# EAGLE design midi-hid (EAGLE 7.7.0)
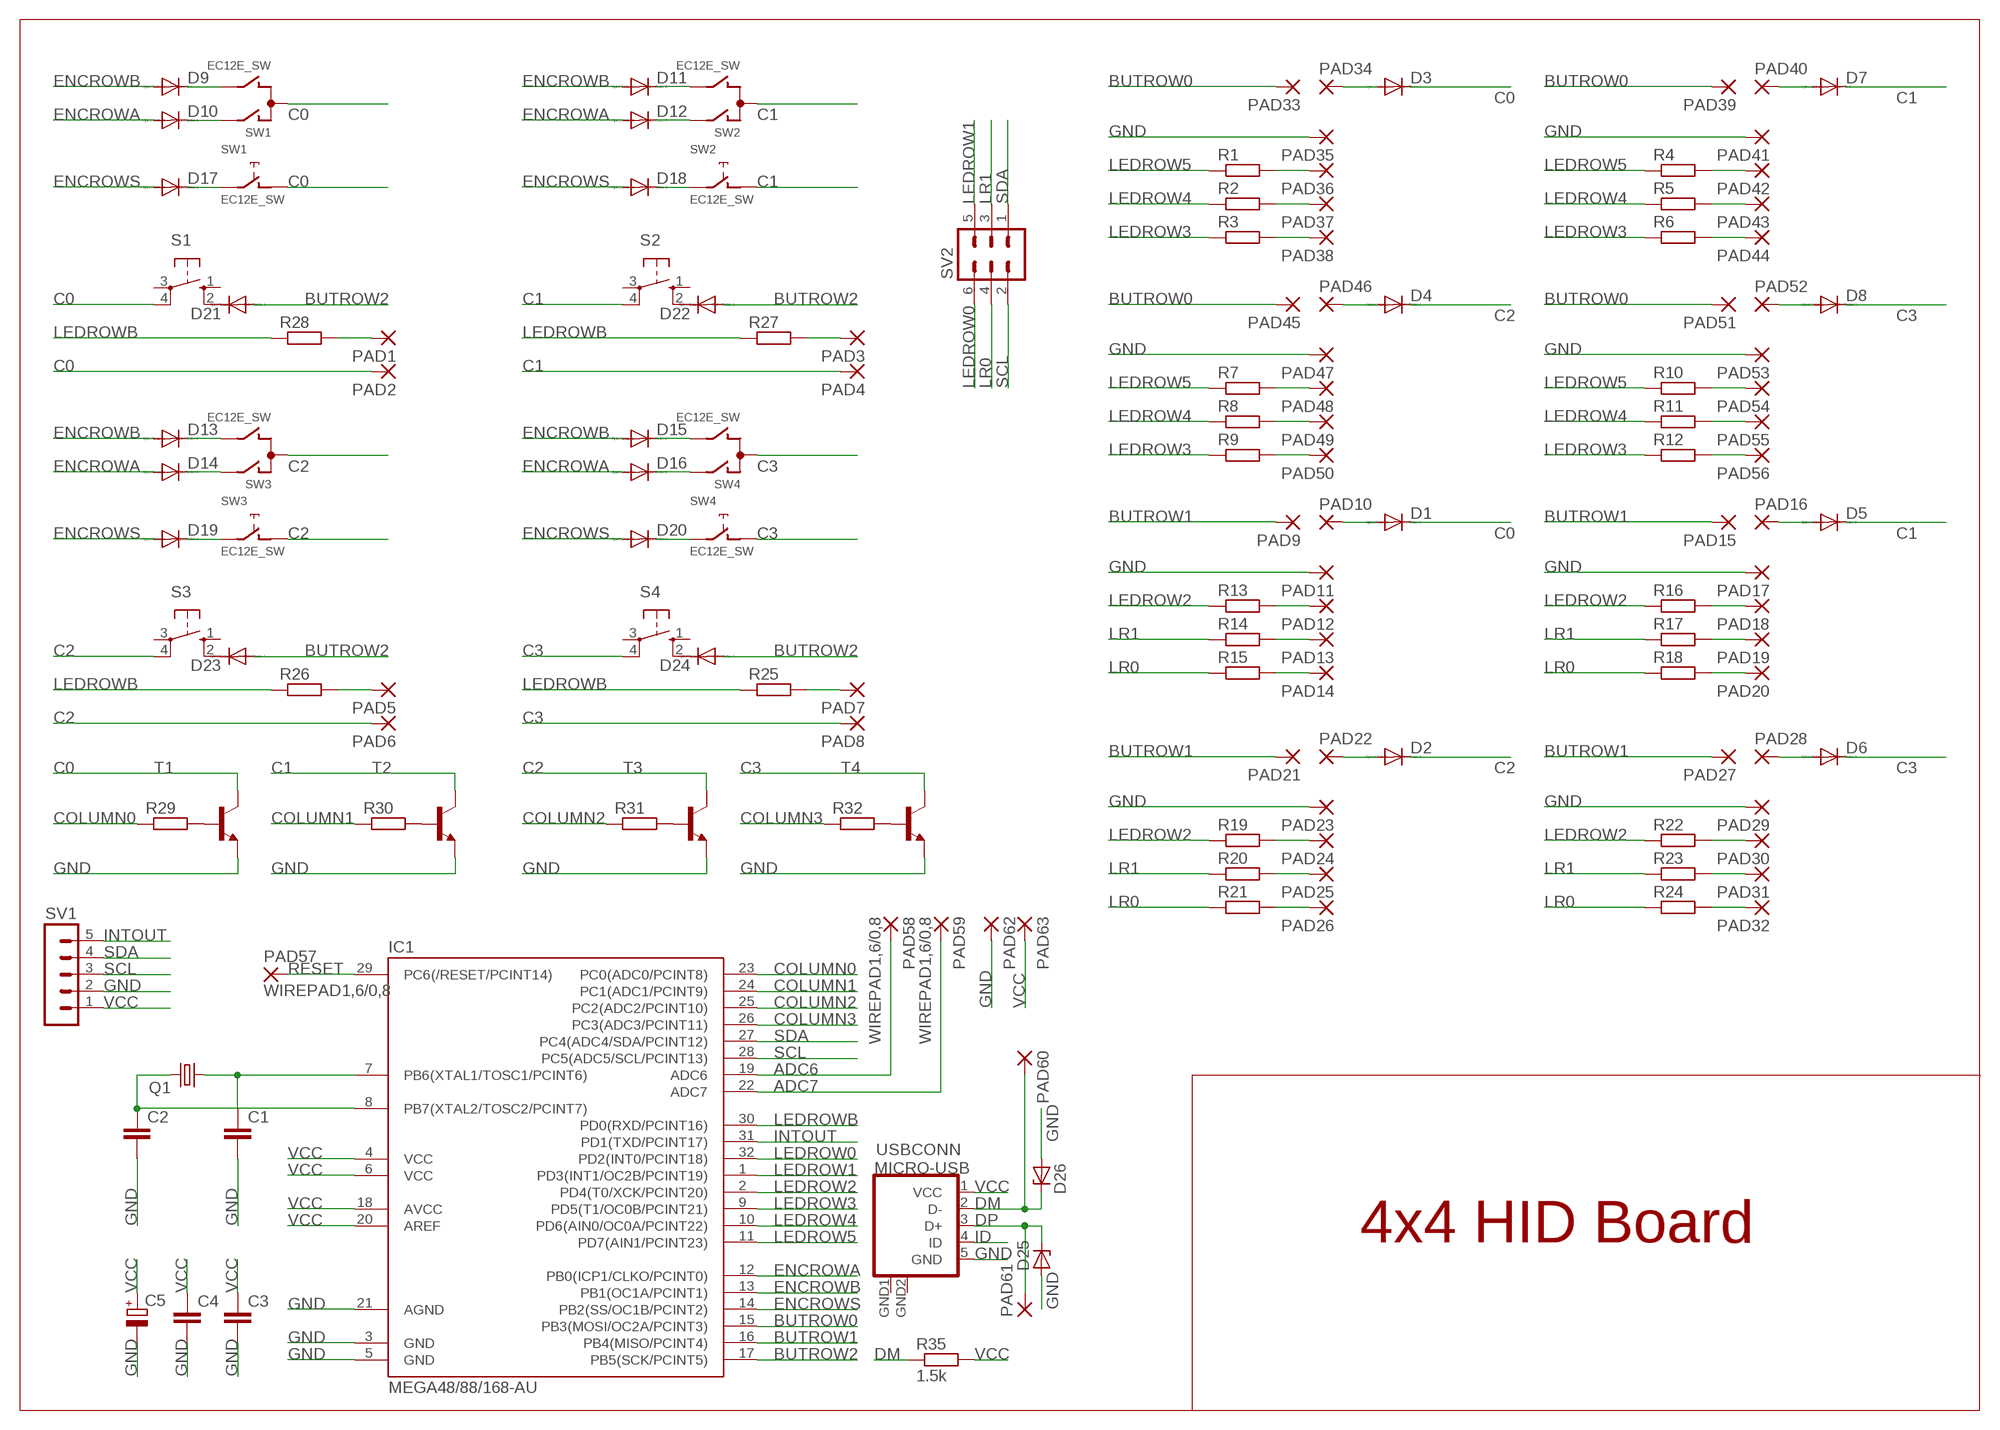
[diagram p0: schematic, sheet 1]

## Parts
C1  C-EUC0805  [C0805]
C2  C-EUC0805  [C0805]
C3  C-EUC0805  [C0805]
C4  C-EUC0805  [C0805]
C5  CPOL-EUE2.5-6  [E2,5-6]
D1  DIODE-SOD80C  [SOD80C]
D2  DIODE-SOD80C  [SOD80C]
D3  DIODE-SOD80C  [SOD80C]
D4  DIODE-SOD80C  [SOD80C]
D5  DIODE-SOD80C  [SOD80C]
D6  DIODE-SOD80C  [SOD80C]
D7  DIODE-SOD80C  [SOD80C]
D8  DIODE-SOD80C  [SOD80C]
D9  DIODE-SOD80C  [SOD80C]
D10  DIODE-SOD80C  [SOD80C]
D11  DIODE-SOD80C  [SOD80C]
D12  DIODE-SOD80C  [SOD80C]
D13  DIODE-SOD80C  [SOD80C]
D14  DIODE-SOD80C  [SOD80C]
D15  DIODE-SOD80C  [SOD80C]
D16  DIODE-SOD80C  [SOD80C]
D17  DIODE-SOD80C  [SOD80C]
D18  DIODE-SOD80C  [SOD80C]
D19  DIODE-SOD80C  [SOD80C]
D20  DIODE-SOD80C  [SOD80C]
D21  DIODE-SOD80C  [SOD80C]
D22  DIODE-SOD80C  [SOD80C]
D23  DIODE-SOD80C  [SOD80C]
D24  DIODE-SOD80C  [SOD80C]
D25  ZENER-DIODESOD80C  [SOD80C]
D26  ZENER-DIODESOD80C  [SOD80C]
IC1  MEGA48/88/168-AU  [TQFP32-08]
PAD1  1,6/0,8  [1,6/0,8]
PAD2  1,6/0,8  [1,6/0,8]
PAD3  1,6/0,8  [1,6/0,8]
PAD4  1,6/0,8  [1,6/0,8]
PAD5  1,6/0,8  [1,6/0,8]
PAD6  1,6/0,8  [1,6/0,8]
PAD7  1,6/0,8  [1,6/0,8]
PAD8  1,6/0,8  [1,6/0,8]
PAD9  1,6/0,8  [1,6/0,8]
PAD10  1,6/0,8  [1,6/0,8]
PAD11  1,6/0,8  [1,6/0,8]
PAD12  1,6/0,8  [1,6/0,8]
PAD13  1,6/0,8  [1,6/0,8]
PAD14  1,6/0,8  [1,6/0,8]
PAD15  1,6/0,8  [1,6/0,8]
PAD16  1,6/0,8  [1,6/0,8]
PAD17  1,6/0,8  [1,6/0,8]
PAD18  1,6/0,8  [1,6/0,8]
PAD19  1,6/0,8  [1,6/0,8]
PAD20  1,6/0,8  [1,6/0,8]
PAD21  1,6/0,8  [1,6/0,8]
PAD22  1,6/0,8  [1,6/0,8]
PAD23  1,6/0,8  [1,6/0,8]
PAD24  1,6/0,8  [1,6/0,8]
PAD25  1,6/0,8  [1,6/0,8]
PAD26  1,6/0,8  [1,6/0,8]
PAD27  1,6/0,8  [1,6/0,8]
PAD28  1,6/0,8  [1,6/0,8]
PAD29  1,6/0,8  [1,6/0,8]
PAD30  1,6/0,8  [1,6/0,8]
PAD31  1,6/0,8  [1,6/0,8]
PAD32  1,6/0,8  [1,6/0,8]
PAD33  1,6/0,8  [1,6/0,8]
PAD34  1,6/0,8  [1,6/0,8]
PAD35  1,6/0,8  [1,6/0,8]
PAD36  1,6/0,8  [1,6/0,8]
PAD37  1,6/0,8  [1,6/0,8]
PAD38  1,6/0,8  [1,6/0,8]
PAD39  1,6/0,8  [1,6/0,8]
PAD40  1,6/0,8  [1,6/0,8]
PAD41  1,6/0,8  [1,6/0,8]
PAD42  1,6/0,8  [1,6/0,8]
PAD43  1,6/0,8  [1,6/0,8]
PAD44  1,6/0,8  [1,6/0,8]
PAD45  1,6/0,8  [1,6/0,8]
PAD46  1,6/0,8  [1,6/0,8]
PAD47  1,6/0,8  [1,6/0,8]
PAD48  1,6/0,8  [1,6/0,8]
PAD49  1,6/0,8  [1,6/0,8]
PAD50  1,6/0,8  [1,6/0,8]
PAD51  1,6/0,8  [1,6/0,8]
PAD52  1,6/0,8  [1,6/0,8]
PAD53  1,6/0,8  [1,6/0,8]
PAD54  1,6/0,8  [1,6/0,8]
PAD55  1,6/0,8  [1,6/0,8]
PAD56  1,6/0,8  [1,6/0,8]
PAD57  WIREPAD1,6/0,8  [1,6/0,8]
PAD58  WIREPAD1,6/0,8  [1,6/0,8]
PAD59  WIREPAD1,6/0,8  [1,6/0,8]
PAD60  1,6/0,8  [1,6/0,8]
PAD61  1,6/0,8  [1,6/0,8]
PAD62  1,6/0,8  [1,6/0,8]
PAD63  1,6/0,8  [1,6/0,8]
Q1  CRYSTALHC49S  [HC49/S]
R1  R-EU_R0805  [R0805]
R2  R-EU_R0805  [R0805]
R3  R-EU_R0805  [R0805]
R4  R-EU_R0805  [R0805]
R5  R-EU_R0805  [R0805]
R6  R-EU_R0805  [R0805]
R7  R-EU_R0805  [R0805]
R8  R-EU_R0805  [R0805]
R9  R-EU_R0805  [R0805]
R10  R-EU_R0805  [R0805]
R11  R-EU_R0805  [R0805]
R12  R-EU_R0805  [R0805]
R13  R-EU_R0805  [R0805]
R14  R-EU_R0805  [R0805]
R15  R-EU_R0805  [R0805]
R16  R-EU_R0805  [R0805]
R17  R-EU_R0805  [R0805]
R18  R-EU_R0805  [R0805]
R19  R-EU_R0805  [R0805]
R20  R-EU_R0805  [R0805]
R21  R-EU_R0805  [R0805]
R22  R-EU_R0805  [R0805]
R23  R-EU_R0805  [R0805]
R24  R-EU_R0805  [R0805]
R25  R-EU_R0805  [R0805]
R26  R-EU_R0805  [R0805]
R27  R-EU_R0805  [R0805]
R28  R-EU_R0805  [R0805]
R29  R-EU_R0805  [R0805]
R30  R-EU_R0805  [R0805]
R31  R-EU_R0805  [R0805]
R32  R-EU_R0805  [R0805]
R35  1.5k  R-EU_R0805  [R0805]
S1  40-XX  [B3F-40XX]
S2  40-XX  [B3F-40XX]
S3  40-XX  [B3F-40XX]
S4  40-XX  [B3F-40XX]
SV1  MA05-1  [MA05-1]
SV2  MA03-2  [MA03-2]
SW1  EC12E_SW  [ALPS_EC12E_SW]
SW2  EC12E_SW  [ALPS_EC12E_SW]
SW3  EC12E_SW  [ALPS_EC12E_SW]
SW4  EC12E_SW  [ALPS_EC12E_SW]
T1  MMBT3904LT1-NPN-SOT23-BEC  [SOT23-BEC]
T2  MMBT3904LT1-NPN-SOT23-BEC  [SOT23-BEC]
T3  MMBT3904LT1-NPN-SOT23-BEC  [SOT23-BEC]
T4  MMBT3904LT1-NPN-SOT23-BEC  [SOT23-BEC]
USBCONN  MICRO-USB  [MICRO-USB]

## Nets
ADC6: IC1.19(ADC6) PAD58.1(P)
ADC7: IC1.22(ADC7) PAD59.1(P)
BUTROW0: IC1.15(PB3(MOSI/OC2A/PCINT3)) PAD33.1(P) PAD39.1(P) PAD45.1(P) PAD51.1(P)
BUTROW1: IC1.16(PB4(MISO/PCINT4)) PAD9.1(P) PAD15.1(P) PAD21.1(P) PAD27.1(P)
BUTROW2: D21.A D22.A D23.A D24.A IC1.17(PB5(SCK/PCINT5))
C0: D1.C D3.C PAD2.1(P) S1.4(P1) SW1.C SW1.D T1.C
C1: D5.C D7.C PAD4.1(P) S2.4(P1) SW2.C SW2.D T2.C
C2: D2.C D4.C PAD6.1(P) S3.4(P1) SW3.C SW3.D T3.C
C3: D6.C D8.C PAD8.1(P) S4.4(P1) SW4.C SW4.D T4.C
COLUMN0: IC1.23(PC0(ADC0/PCINT8)) R29.1
COLUMN1: IC1.24(PC1(ADC1/PCINT9)) R30.1
COLUMN2: IC1.25(PC2(ADC2/PCINT10)) R31.1
COLUMN3: IC1.26(PC3(ADC3/PCINT11)) R32.1
DM: D26.C PAD60.1(P) R35.1 USBCONN.2(D-)
DP: D25.C PAD61.1(P) USBCONN.3(D+)
ENCROWA: D10.A D12.A D14.A D16.A IC1.12(PB0(ICP1/CLKO/PCINT0))
ENCROWB: D9.A D11.A D13.A D15.A IC1.13(PB1(OC1A/PCINT1))
ENCROWS: D17.A D18.A D19.A D20.A IC1.14(PB2(SS/OC1B/PCINT2))
GND: C1.2 C2.2 C3.2 C4.2 C5.- D25.A D26.A IC1.3(GND) IC1.5(GND) IC1.21(AGND) PAD11.1(P) PAD17.1(P) PAD23.1(P) PAD29.1(P) PAD35.1(P) PAD41.1(P) PAD47.1(P) PAD53.1(P) PAD62.1(P) SV1.2 T1.E T2.E T3.E T4.E USBCONN.5(GND)
ID: USBCONN.4(ID)
INTOUT: IC1.31(PD1(TXD/PCINT17)) SV1.5
LEDROW0: IC1.32(PD2(INT0/PCINT18)) SV2.6
LEDROW1: IC1.1(PD3(INT1/OC2B/PCINT19)) SV2.5
LEDROW2: IC1.2(PD4(T0/XCK/PCINT20)) R13.1 R16.1 R19.1 R22.1
LEDROW3: IC1.9(PD5(T1/OC0B/PCINT21)) R3.1 R6.1 R9.1 R12.1
LEDROW4: IC1.10(PD6(AIN0/OC0A/PCINT22)) R2.1 R5.1 R8.1 R11.1
LEDROW5: IC1.11(PD7(AIN1/PCINT23)) R1.1 R4.1 R7.1 R10.1
LEDROWB: IC1.30(PD0(RXD/PCINT16)) R25.1 R26.1 R27.1 R28.1
LR0: R15.1 R18.1 R21.1 R24.1 SV2.4
LR1: R14.1 R17.1 R20.1 R23.1 SV2.3
N$1: D9.C SW1.B
N$2: D10.C SW1.A
N$3: D17.C SW1.E
N$6: D11.C SW2.B
N$7: D12.C SW2.A
N$8: D18.C SW2.E
N$11: D13.C SW3.B
N$12: D14.C SW3.A
N$13: D19.C SW3.E
N$14: D15.C SW4.B
N$15: D16.C SW4.A
N$16: D20.C SW4.E
N$21: C1.1 IC1.7(PB6(XTAL1/TOSC1/PCINT6)) Q1.1
N$22: C2.1 IC1.8(PB7(XTAL2/TOSC2/PCINT7)) Q1.2
N$23: R29.2 T1.B
N$24: PAD36.1(P) R1.2
N$25: PAD37.1(P) R2.2
N$26: PAD38.1(P) R3.2
N$27: R30.2 T2.B
N$28: PAD42.1(P) R4.2
N$29: PAD43.1(P) R5.2
N$30: PAD44.1(P) R6.2
N$31: R31.2 T3.B
N$32: PAD48.1(P) R7.2
N$33: PAD49.1(P) R8.2
N$34: PAD50.1(P) R9.2
N$35: R32.2 T4.B
N$36: PAD54.1(P) R10.2
N$37: PAD55.1(P) R11.2
N$38: PAD56.1(P) R12.2
N$40: D3.A PAD34.1(P)
N$42: D7.A PAD40.1(P)
N$44: D4.A PAD46.1(P)
N$46: D8.A PAD52.1(P)
N$47: PAD14.1(P) R15.2
N$48: PAD13.1(P) R14.2
N$49: PAD12.1(P) R13.2
N$51: PAD20.1(P) R18.2
N$52: PAD19.1(P) R17.2
N$53: PAD18.1(P) R16.2
N$56: PAD24.1(P) R19.2
N$57: PAD25.1(P) R20.2
N$58: PAD26.1(P) R21.2
N$59: PAD32.1(P) R24.2
N$60: PAD31.1(P) R23.2
N$61: PAD30.1(P) R22.2
N$64: D1.A PAD10.1(P)
N$66: D5.A PAD16.1(P)
N$68: D2.A PAD22.1(P)
N$70: D6.A PAD28.1(P)
N$72: PAD1.1(P) R28.2
N$74: PAD3.1(P) R27.2
N$76: PAD5.1(P) R26.2
N$78: PAD7.1(P) R25.2
N$88: D22.C S2.2(S1)
N$89: D21.C S1.2(S1)
N$90: D23.C S3.2(S1)
N$91: D24.C S4.2(S1)
RESET: IC1.29(PC6(/RESET/PCINT14)) PAD57.1(P)
SCL: IC1.28(PC5(ADC5/SCL/PCINT13)) SV1.3 SV2.2
SDA: IC1.27(PC4(ADC4/SDA/PCINT12)) SV1.4 SV2.1
VCC: C3.1 C4.1 C5.+ IC1.4(VCC) IC1.6(VCC) IC1.18(AVCC) IC1.20(AREF) PAD63.1(P) R35.2 SV1.1 USBCONN.1(VCC)
Unconnected: S1.1(S) S1.3(P) S2.1(S) S2.3(P) S3.1(S) S3.3(P) S4.1(S) S4.3(P) SW1.GND1(G) SW1.GND2(G) SW2.GND1(G) SW2.GND2(G) SW3.GND1(G) SW3.GND2(G) SW4.GND1(G) SW4.GND2(G)

## Notes on the sheet
- 4x4 HID Board

## Power pins joined to a net without a drawn wire
GND: USBCONN.GND1(GND) USBCONN.GND2(GND)

## Library data of the parts
C1-C4 = rcl:C-EU: CAPACITOR, European symbol
C5 = rcl:CPOL-EU: POLARIZED CAPACITOR, European symbol
D1-D24 = diode:DIODE-: DIODE
D25 D26 = diode:ZENER-DIODE: Z-Diode
IC1 = avr-7:MEGA48/88/168
PAD1-PAD56 PAD60-PAD63 = wirepad:1,6/0,8: THROUGH-HOLE PAD
PAD57-PAD59 = wirepad:WIREPAD: Wire PAD connect wire on PCB
Q1 = crystal:CRYSTAL: CRYSTAL; OC_FARNELL: 1667008; OC_NEWARK: unknown
R1-R32 R35 = rcl:R-EU_: RESISTOR, European symbol
S1-S4 = switch-omron:40-XX: OMRON SWITCH; MF: OMRON COMPONENTS USA; MPN: B3F-4000; OC_FARNELL: 176434; OC_NEWARK: 36K3105
SV1 = con-lstb:MA05-1: PIN HEADER; OC_FARNELL: unknown; OC_NEWARK: unknown
SV2 = con-lstb:MA03-2: PIN HEADER; OC_FARNELL: unknown; OC_NEWARK: unknown
SW1-SW4 = switch-alps:EC12E_SW: ALPS rotary Encoder EC12E series with switch; MPN: EC12E2424407; OC_FARNELL: 1520813; OC_NEWARK: 74M1068
T1-T4 = transistor:*-NPN-: NPN Transistror BF959 corrected 2008.03.06
USBCONN = microusb:MICRO-USB: Micro USB B connector

## Board
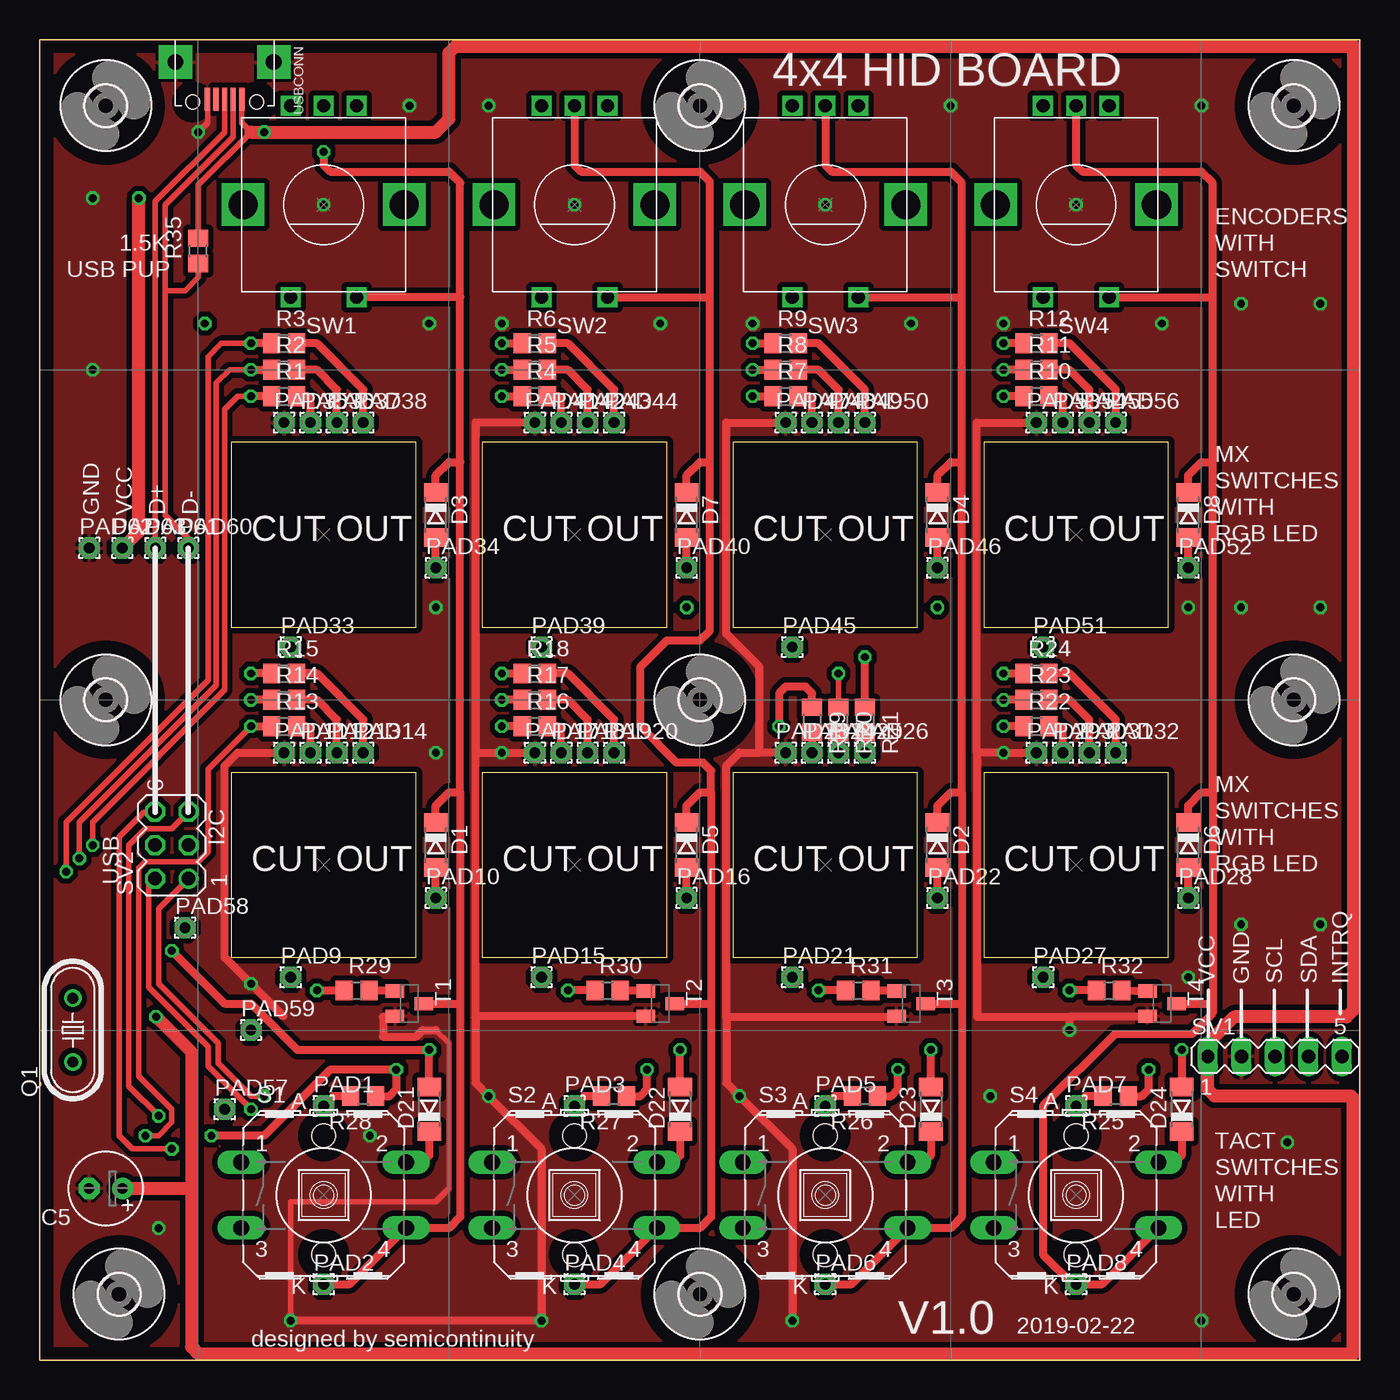
[diagram p1: board, top side]
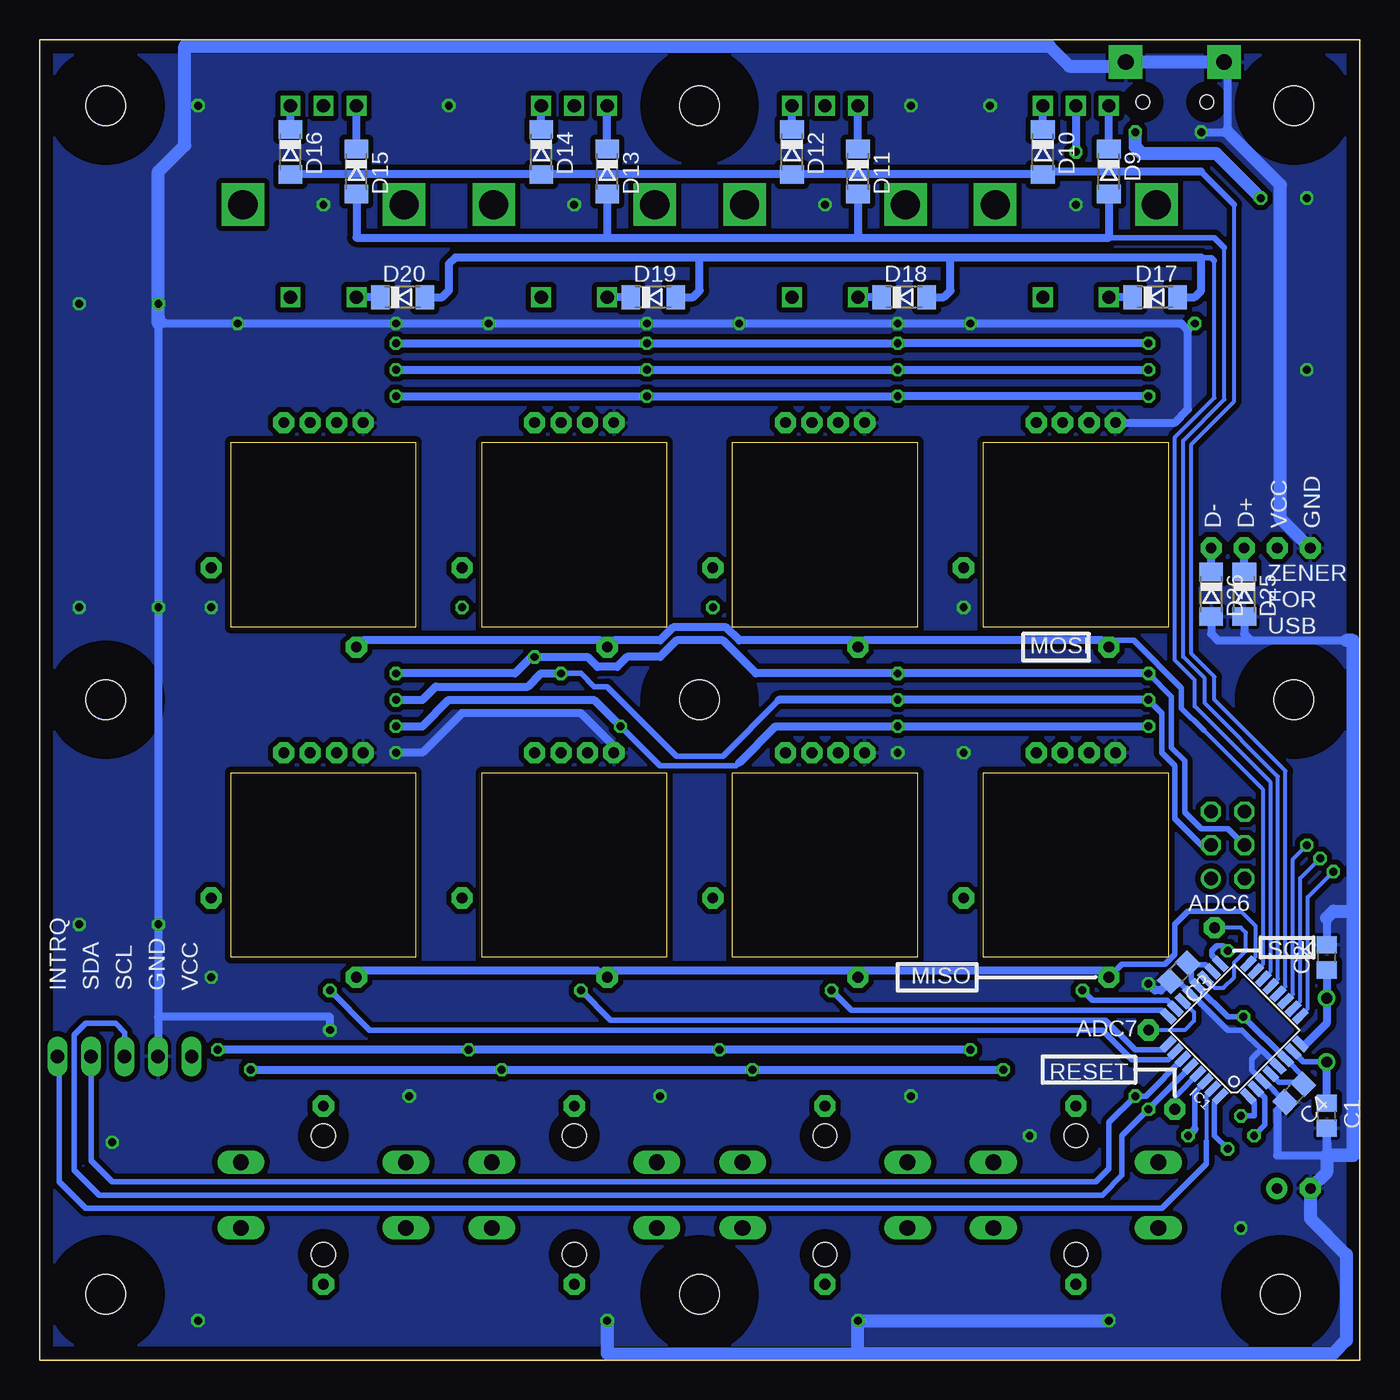
[diagram p2: board, bottom side, seen from below]

Size 100 x 100 mm. Coordinates in mm from the lower left corner, seen from the top.
Outline: 0,0 100,0 100,100 0,100 0,0
Copper layers (1*16): Top 0.035mm / dielectric 1.5mm / Bottom 0.035mm
Design rules "default": minimum track width 10mil, minimum drill 24mil, track to track 8mil, track to pad 8mil, pad to pad 8mil, via to via 8mil, smd to smd 8mil, copper to edge 40mil, drill to drill 8mil, minimum pad ring 10mil, minimum via ring 8mil, stop-mask expansion 4mil, vias tented up to drill 0mil, thermal gap 10mil
tRestrict: area 33.5,55.5 to 47.5,69.5; area 52.5,55.5 to 66.5,69.5; area 71.5,55.5 to 85.5,69.5; area 14.5,55.5 to 28.5,69.5; area 14.5,30.5 to 28.5,44.5; area 33.5,30.5 to 47.5,44.5; area 52.5,30.5 to 66.5,44.5; area 71.5,30.5 to 85.5,44.5
bRestrict: area 14.5,30.5 to 28.5,44.5; area 33.5,30.5 to 47.5,44.5; area 52.5,30.5 to 66.5,44.5; area 71.5,30.5 to 85.5,44.5; area 14.5,55.5 to 28.5,69.5; area 33.5,55.5 to 47.5,69.5; area 52.5,55.5 to 66.5,69.5; area 71.5,55.5 to 85.5,69.5
Milling: 36 lines

### Footprints (pad centres in the part's own frame; a part is rotated, then mirrored left to right if it is on the bottom)
C0805 = smd 1.3 x 1.5: 1 -0.95,0; 2 0.95,0
E2,5-6 = drill 0.813 pad 1.6: + -1.27,0 | drill 0.813 pad 1.6 octagon: - 1.27,0
SOD80C = smd 1.4 x 1.8: A 1.7,0; C -1.7,0
TQFP32-08 = smd 1.27 x 0.559: 1 -4.293,2.8; 2 -4.293,2; 3 -4.293,1.2; 4 -4.293,0.4; 5 -4.293,-0.4; 6 -4.293,-1.2; 7 -4.293,-2; 8 -4.293,-2.8; 17 4.293,-2.8; 18 4.293,-2; 19 4.293,-1.2; 20 4.293,-0.4; 21 4.293,0.4; 22 4.293,1.2; 23 4.293,2; 24 4.293,2.8 | smd 0.559 x 1.27: 9 -2.8,-4.293; 10 -2,-4.293; 11 -1.2,-4.293; 12 -0.4,-4.293; 13 0.4,-4.293; 14 1.2,-4.293; 15 2,-4.293; 16 2.8,-4.293; 25 2.8,4.293; 26 2,4.293; 27 1.2,4.293; 28 0.4,4.293; 29 -0.4,4.293; 30 -1.2,4.293; 31 -2,4.293; 32 -2.8,4.293
1,6/0,8 = drill 0.813 pad 1.6 octagon: 1 0,0
HC49/S = drill 0.813: 1 -2.413,0; 2 2.413,0
R0805 = smd 1.3 x 1.5: 1 -0.95,0; 2 0.95,0
B3F-40XX = drill 1.194 long: 1 -6.248,2.489; 2 6.248,2.489; 3 -6.248,-2.489; 4 6.248,-2.489 | hole 1.803: 0,-4.496; 0,4.496
MA05-1 = drill 1.016 long: 1 -5.08,0; 2 -2.54,0; 3 0,0; 4 2.54,0; 5 5.08,0
MA03-2 = drill 1.016: 1 -2.54,-1.27 | drill 1.016 octagon: 2 -2.54,1.27; 3 0,-1.27; 4 0,1.27; 5 2.54,-1.27; 6 2.54,1.27
ALPS_EC12E_SW = drill 1 square: A -2.5,-7.5; B 2.5,-7.5; C 0,-7.5; D -2.5,7; E 2.5,7 | drill 2.2 square: GND1 -6.1,0; GND2 6.1,0
SOT23-BEC = smd 1 x 1.4: B -0.95,-1.1; C 0,1.1; E 0.95,-1.1
3,0 = hole 3: 0,0
MICRO-USB = smd 0.4 x 1.75: 1 -1.3,4.525; 2 -0.65,4.525; 3 0,4.525; 4 0.65,4.525; 5 1.3,4.525 | drill 1.2 pad 2.54 square: GND1 -3.725,1.7; GND2 3.725,1.7 | hole 1.05: -2.425,4.73; 2.425,4.73

### Placement (x,y rotation side)
C1  2.5,18.5 270 bottom
C2  2.5,30.5 90 bottom
C3  13.69,29.38 225 bottom
C4  4.96,20.22 225 bottom
C5  5,13 180 top
D1  30,39 270 top
D2  68,39 270 top
D3  30,64 270 top
D4  68,64 270 top
D5  49,39 270 top
D6  87,39 270 top
D7  49,64 270 top
D8  87,64 270 top
D9  19,90 270 bottom
D10  24,91.5 270 bottom
D11  38,90 270 bottom
D12  43,91.5 270 bottom
D13  57,90 270 bottom
D14  62,91.5 270 bottom
D15  76,90 270 bottom
D16  81,91.5 270 bottom
D17  15.5,80.5 0 bottom
D18  34.5,80.5 0 bottom
D19  53.5,80.5 0 bottom
D20  72.5,80.5 0 bottom
D21  29.5,19 90 top
D22  48.5,19 90 top
D23  67.5,19 90 top
D24  86.5,19 90 top
D25  8.75,58 270 bottom
D26  11.25,58 270 bottom
IC1  9.5,25 135 bottom
PAD1  21.5,19.25 0 top
PAD2  21.5,5.75 0 top
PAD3  40.5,19.25 0 top
PAD4  40.5,5.75 0 top
PAD5  59.5,19.25 0 top
PAD6  59.5,5.75 0 top
PAD7  78.5,19.25 0 top
PAD8  78.5,5.75 0 top
PAD9  19,29 0 top
PAD10  30,35 0 top
PAD11  18.5,46 0 top
PAD12  20.5,46 0 top
PAD13  22.5,46 0 top
PAD14  24.5,46 0 top
PAD15  38,29 0 top
PAD16  49,35 0 top
PAD17  37.5,46 0 top
PAD18  39.5,46 0 top
PAD19  41.5,46 0 top
PAD20  43.5,46 0 top
PAD21  57,29 0 top
PAD22  68,35 0 top
PAD23  56.5,46 0 top
PAD24  58.5,46 0 top
PAD25  60.5,46 0 top
PAD26  62.5,46 0 top
PAD27  76,29 0 top
PAD28  87,35 0 top
PAD29  75.5,46 0 top
PAD30  77.5,46 0 top
PAD31  79.5,46 0 top
PAD32  81.5,46 0 top
PAD33  19,54 0 top
PAD34  30,60 0 top
PAD35  18.5,71 0 top
PAD36  20.5,71 0 top
PAD37  22.5,71 0 top
PAD38  24.5,71 0 top
PAD39  38,54 0 top
PAD40  49,60 0 top
PAD41  37.5,71 0 top
PAD42  39.5,71 0 top
PAD43  41.5,71 0 top
PAD44  43.5,71 0 top
PAD45  57,54 0 top
PAD46  68,60 0 top
PAD47  56.5,71 0 top
PAD48  58.5,71 0 top
PAD49  60.5,71 0 top
PAD50  62.5,71 0 top
PAD51  76,54 0 top
PAD52  87,60 0 top
PAD53  75.5,71 0 top
PAD54  77.5,71 0 top
PAD55  79.5,71 0 top
PAD56  81.5,71 0 top
PAD57  14,19 0 top
PAD58  11,32.75 0 top
PAD59  16,25 0 top
PAD60  11.25,61.5 0 top
PAD61  8.75,61.5 0 top
PAD62  3.75,61.5 0 top
PAD63  6.25,61.5 0 top
Q1  2.5,25 90 top
R1  18.5,73 0 top
R2  18.5,75 0 top
R3  18.5,77 0 top
R4  37.5,73 0 top
R5  37.5,75 0 top
R6  37.5,77 0 top
R7  56.5,73 0 top
R8  56.5,75 0 top
R9  56.5,77 0 top
R10  75.5,73 0 top
R11  75.5,75 0 top
R12  75.5,77 0 top
R13  18.5,48 0 top
R14  18.5,50 0 top
R15  18.5,52 0 top
R16  37.5,48 0 top
R17  37.5,50 0 top
R18  37.5,52 0 top
R19  58.5,48.5 270 top
R20  60.5,48.5 270 top
R21  62.5,48.5 270 top
R22  75.5,48 0 top
R23  75.5,50 0 top
R24  75.5,52 0 top
R25  81.5,20 180 top
R26  62.5,20 180 top
R27  43.5,20 180 top
R28  24.5,20 180 top
R29  24,28 0 top
R30  43,28 0 top
R31  62,28 0 top
R32  81,28 0 top
R35  12,84 90 top
S1  21.5,12.5 0 top
S2  40.5,12.5 0 top
S3  59.5,12.5 0 top
S4  78.5,12.5 0 top
SV1  93.56,23 0 top
SV2  10,39 90 top
SW1  21.5,87.5 180 top
SW2  40.5,87.5 180 top
SW3  59.5,87.5 180 top
SW4  78.5,87.5 180 top
T1  28,27 270 top
T2  47,27 270 top
T3  66,27 270 top
T4  85,27 270 top
U$1  [3,0]  95,5 0 top
U$2  [3,0]  50,5 0 top
U$3  [3,0]  95,95 0 top
U$4  [3,0]  6,5 0 top
U$5  [3,0]  5,50 0 top
U$6  [3,0]  95,50 0 top
U$7  [3,0]  50,50 0 top
U$8  [3,0]  50,95 0 top
U$9  [3,0]  5,95 0 top
USBCONN  14,100 180 top

### Tracks (layer width: path | path; a pad name or v marks a point on that pad's centre or on a via)
ADC6
  Bottom 0.303: 9.5,29 9.5,30.12
  Bottom 0.305: IC1.19 11,28.19 10.31,28.19 9.5,29 | 9.5,30.12 8.62,31 8.62,32.38 9,32.75 PAD58.1
ADC7
  Bottom 0.305: IC1.22 12.56,26.36 12.56,25.69 13.25,25 PAD59.1
BUTROW0
  Bottom 0.305: IC1.15 7.31,30.02 7.31,43.19 11.81,47.69
  Bottom 0.406: PAD33.1 18.5,54.5 17.12,54.5 13.5,50.88 13.5,49.38 11.81,47.69
  Bottom 0.61: PAD33.1 19.5,54.5 37.5,54.5 PAD39.1 38.5,54.5 47,54.5 48,55.5 52,55.5 53,54.5 56.5,54.5 PAD45.1 57.5,54.5 75.5,54.5 PAD51.1
BUTROW1
  Bottom 0.305: IC1.16 7.88,30.59 7.88,32.88 9,34
  Bottom 0.406: PAD9.1 18,30 14.75,30 14,30.75 14,33 13,34 9,34
  Bottom 0.61: PAD9.1 19.5,29.5 37.5,29.5 PAD15.1 38.5,29.5 56.5,29.5 PAD21.1 57.25,29 57.75,29.5 75.5,29.5 PAD27.1
BUTROW2  (via drill 0.6)
  Top 0.61: D21.A v29.5,23.5 19.5,23.5 16,27 14,27 v10,31 | v86.5,23.5 D24.A | D23.A v67.5,23.5 | D22.A v48.5,23.5
  Bottom 0.406: IC1.17 11.19,30.65 11.19,31 10.81,31.38 10.38,31.38 v10,31
  Bottom 0.61: v29.5,23.5 v48.5,23.5 v67.5,23.5 v86.5,23.5
C0  (via drill 0.6)
  Top 0.61: 31.85,43 31.85,68 | 31.85,68 31.85,80.5 | 31.85,80.5 31.85,89.15 31,90 22,90 21.5,90.5 v21.5,91.5 | 31.85,80.5 SW1.D | D1.C 30,42 31,43 31.85,43 | D3.C 30,67 31,68 31.85,68 | 31.85,43 31.85,27 | T1.C 31.85,27 | 31.85,27 31.85,10.85 31,10 S1.4 23.49,5.75 PAD2.1
  Bottom 0.61: SW1.C v21.5,91.5
C1
  Top 0.61: 50.85,43 50.85,44.65 50.25,45.25 48.25,45.25 45.5,48 45.5,52.5 47.5,54.5 50,54.5 50.75,55.25 50.75,68 | 50.75,68 50.75,80.5 | 50.75,80.5 50.75,89.25 50,90 41,90 40.5,90.5 SW2.C | SW2.D 50.75,80.5 | D7.C 49,67 50,68 50.75,68 | D5.C 49,42 50,43 50.85,43 | 50.85,43 50.85,27 | 50.85,27 50.85,10.85 50,10 S2.4 42.49,5.75 PAD4.1 | T2.C 50.85,27
C2
  Top 0.61: 69.85,43 69.85,68 | 69.85,68 69.85,80.5 | 69.85,80.5 69.85,89.15 69,90 60,90 59.5,90.5 SW3.C | SW3.D 69.85,80.5 | D4.C 68,67 69,68 69.85,68 | D2.C 68,42 69,43 69.85,43 | 69.85,43 69.85,27 | 69.85,27 69.85,10.85 69,10 S3.4 61.49,5.75 PAD6.1 | T3.C 69.85,27
C3
  Top 0.61: SW4.C 78.5,90.5 79,90 88,90 88.85,89.15 88.85,80.5 | 88.85,43 88.85,68 | 88.85,68 88.85,80.5 | SW4.D 88.85,80.5 | D8.C 87,67 88,68 88.85,68 | D6.C 87,42 88,43 88.85,43 | 88.85,43 88.85,27 | S4.4 80.49,5.75 PAD8.1 78.25,5.75 76,8 76,19.25 81.44,24.69 87.25,24.69 88.85,26.29 88.85,27 | T4.C 88.85,27
COLUMN0  (via drill 0.6)
  Top 0.61: v21,28 R29.1
  Bottom 0.406: IC1.23 14.58,27.25 20.25,27.25 v21,28
COLUMN1  (via drill 0.6)
  Top 0.61: R30.1 v40,28
  Bottom 0.406: IC1.24 14.55,26.05 15,26.5 38.5,26.5 v40,28
COLUMN2  (via drill 0.6)
  Top 0.61: R31.1 v59,28
  Bottom 0.406: IC1.25 14.96,23.5 17,23.5 19.25,25.75 56.75,25.75 v59,28
COLUMN3  (via drill 0.6)
  Top 0.61: R32.1 v78,28
  Bottom 0.406: IC1.26 13.95,23.3 14.5,22.75 17.25,22.75 19.5,25 75,25 v78,28
DM
  Top 0.406: USBCONN.2 14.65,92.65 9.5,87.5 9.5,81 | 9.5,81 9.5,64 11.25,62.25 PAD60.1 | R35.1 12,82 11,81 9.5,81
  Bottom 0.61: D26.C PAD60.1
DP
  Top 0.406: PAD61.1 8.75,87.75 14,93 USBCONN.3
  Bottom 0.61: D25.C PAD61.1
ENCROWA
  Bottom 0.305: IC1.12 5.62,28.31 5.62,44.62 11,50 11,51.75 12.75,53.5 12.75,69.38 9.5,72.62 9.5,87.5
  Bottom 0.406: 9.5,87.5 12,90
  Bottom 0.61: 12,90 23.8,90 D10.A D12.A D14.A D16.A
ENCROWB
  Bottom 0.305: IC1.13 6.19,28.88 6.19,44.19 11.75,49.75 11.75,51.62 13.38,53.25 13.38,69.62 10.25,72.75 10.25,84.25
  Bottom 0.406: 10.25,84.25 11,85 19,85
  Bottom 0.61: D9.A 19,85 38,85 | D11.A 38,85 | D13.A 57,85 | 57,85 38,85 | D15.A 76,85 57,85
ENCROWS
  Bottom 0.305: IC1.14 6.75,29.45 6.75,43.75 12.5,49.5 12.5,51.5 14,53 14,69.88 11,72.88 11,83.25
  Bottom 0.406: 11,83.25 11.25,83.5 12,83.5
  Bottom 0.61: 31,83.5 12,83.5 12,81 12.5,80.5 D17.A | 31,83.5 50,83.5 | 50,83.5 68.5,83.5 69,83 69,81 69.5,80.5 D20.A | D19.A 50.5,80.5 50,81 50,83.5 | D18.A 31.5,80.5 31,81 31,83.5
GND  (via drill 0.6)
  Top 0.406: USBCONN.5 12.7,93.7 v12,93 | 30,25 31,24 31,13 30,12 19,12 v19,3
  Top 0.61: PAD41.1 33,71 33,46 | 33,46 v35,46 PAD17.1 | PAD23.1 54.5,46 | 54.5,46 54.5,52.5 52,55 52,71 PAD47.1 | 71,46 71,71 PAD53.1 | 52,26 52,45 53,46 54.5,46 | 52,26 64.85,26 T3.E | T2.E 33.05,26.05 33,26 | 33,26 33,46 | 71,46 v73,46 PAD29.1 | 71,46 71,26 78,26 | T4.E 83.85,26 78,26 | 78,26 v78,25 | PAD11.1 15,46 14,45 14,30.5 v16,28.5 18.45,26.05 | T1.E 26.85,26 26,26 26,24.5 28.5,24.5 29,25 30,25 | 33,26 33,21 v34,20 38,16 v38,3 v19,3 | 52,26 52,21 v53,20 57,16 v57,3
  Bottom 0.406: C3.2 14.16,28.5 13.56,28.5 IC1.21 12.75,27.75 10,25 8.93,25 7.47,23.53 | C4.2 7.19,21.12 IC1.3 7.37,21.12 8.19,21.94 8.19,22.81 7.47,23.53 | 7.47,23.53 IC1.5
  Bottom 0.61: 2.45,15.5 C1.2 2.5,15.5 6.25,15.5 6.25,18.88 5.63,19.5 C4.2 | 2.5,33.5 C2.2 | PAD23.1 56.5,46.5 59,49 68,49 71,46 v73,46 | C3.2 15.06,28 15.5,28 v16,28.5 | PAD35.1 14,71 13,72 13,78 13.5,78.5 v29.5,78.5 v35,78.5 v47,78.5 v54,78.5 v66,78.5 v73,78.5 v85,78.5 90.5,78.5 91,79 | 91,78.5 91.02,78.48 91.02,26 | 91.02,26 SV1.2 | v78,25 78,26 91.02,26 | v12,93 10,93 10,98.03 USBCONN.GND2 | D25.A 8.75,55 8.25,54.5 | 8.25,54.5 1,54.5 | D26.A 11.25,55 10.75,54.5 8.25,54.5
  Bottom 1: 91,78.5 91,79 v91,80 91,90 89,92 89,99.5 23.5,99.5 22,98 18.02,98 USBCONN.GND1 USBCONN.GND2 | 2.5,15.5 2.5,14.23 C5.- 3.73,10.73 1,8 1,1.5 2,0.5 38,0.5 | 0.5,33.5 0.5,34 | 0.5,34 0.5,54.5 1,54.5 | 2.5,33.5 2,34 0.5,34 | PAD62.1 6,63.75 6,89 10,93 | v57,3 57,0.5 38,0.5 | 38,0.5 v38,3 v19,3
  Bottom 1.016: 0.5,33.5 0.5,15.5 2.45,15.5 2.5,15.5
  other vias: 30,46 30,57 87,29 87,57 97,57 97,33 88,3 94.5,16.5 9,10 97,80 88,95 69,95 78.5,87.5 59.5,87.5 34,95 4,88 4,75 28,95 91,33 25,17 72,20 21.5,87.5 40.5,87.5 91,57
  pour Bottom (isolate 0.406): 0,0 0,100 100,100 100,0
  pour Top (isolate 0.406): 0,0 0,100 100,100 100,0
INTOUT
  Bottom 0.305: IC1.31 11.62,20.05 11.62,16.56
  Bottom 0.406: 11.62,16.56 11.62,14.88 15,11.5 96.5,11.5 98.5,13.5 98.5,22.86 SV1.5
LEDROW0  (via drill 0.6)
  Top 0.406: v10,16 7,16 6,17 6,39.62 7.88,41.5 8.69,41.5 SV2.6
  Bottom 0.406: IC1.32 10.55,19.95 11,19.5 11,17 v10,16
LEDROW1  (via drill 0.6)
  Top 0.406: v9,18.5 6.75,20.75 6.75,39 8,40.25 9.98,40.25 SV2.5
  Bottom 0.406: IC1.1 8.45,19.95 8,19.5 8,18.5 v9,18.5
LEDROW2  (via drill 0.6)
  Top 0.406: v8,17 9,17 10,18 10,19 7.5,21.5 7.5,37.25 8,37.75 12,37.75 12.75,38.5 12.75,44.75 v16,48
  Top 0.61: R16.1 v35,48 | v16,48 R13.1 | R22.1 v73,48 | R19.1 58.5,50.5 58,51 56.5,51 56,50.5 v56,48
  Bottom 0.406: 47,45.25 47.25,45 53,45 v56,48 | IC1.2 7.19,19.86 7.19,17.81 v8,17
  Bottom 0.61: v16,48 v35,48 44.25,48 47,45.25 | v73,48 71,48 69,50 58,50 v56,48
LEDROW3  (via drill 0.6)
  Top 0.406: v2,37 2,40.75 12.75,51.5 12.75,76 13.75,77 v16,77
  Top 0.61: R3.1 v16,77 | v35,77 R6.1 | R12.1 v73,77 | v54,77 R9.1
  Bottom 0.305: IC1.9 3.94,26.6 3.94,35.06 v2,37
  Bottom 0.61: v16,77 v35,77 v54,77 v73,77
LEDROW4  (via drill 0.6)
  Top 0.406: v3,38 3,40.75 13.38,51.12 13.38,74 14.38,75 v16,75
  Top 0.61: R11.1 v73,75 | v54,75 R8.1 | v35,75 R5.1 | v16,75 R2.1
  Bottom 0.305: IC1.10 4.5,27.17 4.5,36.5 v3,38
  Bottom 0.61: v73,75 v54,75 v35,75 v16,75
LEDROW5  (via drill 0.6)
  Top 0.406: v4,39 4,40.75 14,50.75 14,72 15,73 v16,73
  Top 0.61: R1.1 v16,73 | v35,73 R4.1 | R10.1 v73,73 | v54,73 R7.1
  Bottom 0.305: IC1.11 5.06,27.74 5.06,37.94 v4,39
  Bottom 0.61: v16,73 v35,73 v54,73 v73,73
LEDROWB  (via drill 0.6)
  Top 0.61: R28.1 26.5,20 27,20.5 v27,22 22,22 17,17 v13,17 | R25.1 83.5,20 84,20.5 v84,22 | R27.1 45.5,20 46,20.5 v46,22 | R26.1 64.5,20 65,20.5 v65,22
  Bottom 0.406: IC1.30 12.5,20.3 12.5,17.5
  Bottom 0.61: v84,22 v65,22 v46,22 v27,22 | v13,17 12.5,17.5
LR0  (via drill 0.6)
  Top 0.61: R15.1 v16,52 | v35,52 R18.1 | R21.1 v62.5,53.25 | v73,52 R24.1
  Bottom 0.406: SV2.4 9.98,40.25 12,40.25 13.25,41.5 13.25,45.38 14.25,46.38 14.25,50.25 v16,52
  Bottom 0.61: v16,52 v35,52 45.75,52 48.25,54.5 51.75,54.5 53,53.25 55.5,53.25 56.25,52.5 57.75,52.5 58.5,53.25 v62.5,53.25 62.75,53.25 64,52 v73,52
LR1  (via drill 0.6)
  Top 0.406: R20.1 v60.5,52
  Top 0.61: R14.1 v16,50 | R17.1 v35,50 | R23.1 v73,50
  Bottom 0.406: SV2.3 12,39 14,41 14,45 15,46 15,49 v16,50 | 44,50 48.25,45.75 51.75,45.75 57,51 58,51 59,52 v60.5,52
  Bottom 0.61: v16,50 v35,50 44,50 | v73,50 71,50 70,51 63,51 62,52 v60.5,52
N$1
  Bottom 0.61: D9.C SW1.B
N$2
  Bottom 0.61: D10.C SW1.A
N$3
  Bottom 0.61: D17.C SW1.E
N$6
  Bottom 0.61: D11.C SW2.B
N$7
  Bottom 0.61: D12.C SW2.A
N$8
  Bottom 0.61: D18.C SW2.E
N$11
  Bottom 0.61: D13.C SW3.B
N$12
  Bottom 0.61: D14.C SW3.A
N$13
  Bottom 0.61: D19.C SW3.E
N$14
  Bottom 0.61: D15.C SW4.B
N$15
  Bottom 0.61: D16.C SW4.A
N$16
  Bottom 0.61: D20.C SW4.E
N$21
  Bottom 0.406: IC1.7 4.26,22.59 Q1.1
  Bottom 0.61: C1.1 Q1.1
N$22
  Bottom 0.406: 4,24 4.43,24 IC1.8
  Bottom 0.61: 4,24 2.5,25.5 Q1.2 C2.1
N$23
  Top 0.61: R29.2 26.85,28 T1.B
N$24
  Top 0.61: PAD36.1 20.5,72.75 20.25,73 R1.2
N$25
  Top 0.61: PAD37.1 22.5,73.5 21,75 R2.2
N$26
  Top 0.61: PAD38.1 24.5,73.5 21,77 R3.2
N$27
  Top 0.61: R30.2 45.85,28 T2.B
N$28
  Top 0.61: PAD42.1 39.5,72.75 39.25,73 R4.2
N$29
  Top 0.61: PAD43.1 41.5,73.5 40,75 R5.2
N$30
  Top 0.61: PAD44.1 43.5,73.5 40,77 R6.2
N$31
  Top 0.61: R31.2 64.85,28 T3.B
N$32
  Top 0.61: PAD48.1 58.5,72.75 58.25,73 R7.2
N$33
  Top 0.61: PAD49.1 60.5,73.5 59,75 R8.2
N$34
  Top 0.61: PAD50.1 62.5,73.5 59,77 R9.2
N$35
  Top 0.61: T4.B 83,27.95 R32.2
N$36
  Top 0.61: PAD54.1 77.5,72.75 77.25,73 R10.2
N$37
  Top 0.61: PAD55.1 79.5,73.5 78,75 R11.2
N$38
  Top 0.61: PAD56.1 81.5,73.5 78,77 R12.2
N$40
  Top 0.61: PAD34.1 D3.A
N$42
  Top 0.61: PAD40.1 D7.A
N$44
  Top 0.61: PAD46.1 D4.A
N$46
  Top 0.61: PAD52.1 D8.A
N$47
  Top 0.61: PAD14.1 24.5,48.5 21,52 R15.2
N$48
  Top 0.61: PAD13.1 22.5,48.5 21,50 R14.2
N$49
  Top 0.61: PAD12.1 20.5,47.75 20.25,48 R13.2
N$51
  Top 0.61: PAD20.1 43.5,48.5 40,52 R18.2
N$52
  Top 0.61: PAD19.1 41.5,48.5 40,50 R17.2
N$53
  Top 0.61: PAD18.1 39.5,47.75 39.25,48 R16.2
N$56
  Top 0.61: R19.2 PAD24.1
N$57
  Top 0.61: R20.2 PAD25.1
N$58
  Top 0.61: R21.2 PAD26.1
N$59
  Top 0.61: PAD32.1 81.5,48.5 78,52 R24.2
N$60
  Top 0.61: PAD31.1 79.5,48.5 78,50 R23.2
N$61
  Top 0.61: PAD30.1 77.5,47.75 77.25,48 R22.2
N$64
  Top 0.61: PAD10.1 D1.A
N$66
  Top 0.61: PAD16.1 D5.A
N$67  (via drill 0.6)
  other vias: 12.5,78.5
N$68
  Top 0.61: PAD22.1 D2.A
N$70
  Top 0.61: PAD28.1 D6.A
N$71  (via drill 0.6)
  other vias: 68,57
N$72
  Top 0.61: R28.2 22.25,20 PAD1.1
N$73  (via drill 0.6)
  other vias: 49,57
N$74
  Top 0.61: R27.2 41.25,20 PAD3.1
N$76
  Top 0.61: R26.2 60.25,20 PAD5.1
N$78
  Top 0.61: R25.2 79.25,20 PAD7.1
N$88
  Top 0.61: S2.2 48,15 48.5,15.5 D22.C
N$89
  Top 0.61: S1.2 29,15 29.5,15.5 D21.C
N$90
  Top 0.61: S3.2 67,15 67.5,15.5 D23.C
N$91
  Top 0.61: S4.2 86,15 86.5,15.5 D24.C
RESET
  Bottom 0.305: 13.93,20 14,20 PAD57.1
  Bottom 0.406: IC1.29 13.93,20
SCL  (via drill 0.6)
  Top 0.406: v16,19 12.75,22.25 12.75,23.75 8.25,28.25 8.25,35.98 SV2.2
  Bottom 0.406: IC1.28 12.82,22.18 v16,19 18,17 18,14 19.5,12.5 95.5,12.5 97.38,14.38 97.38,24.62 96.5,25.5 94.25,25.5 93.56,24.81 SV1.3
SDA  (via drill 0.6)
  Top 0.406: v17,20 16,20 13.5,22.5 13.5,24 9,28.5 9,34.19 SV2.1
  Bottom 0.406: IC1.27 16.2,20 v17,20 19,18 19,14.5 20,13.5 94.5,13.5 96.1,15.1 SV1.4
VCC  (via drill 0.6)
  Top 0.406: USBCONN.1 15.3,93.7 16,93 12,89 R35.2 | 88.5,23.02 SV1.1
  Top 1: v8.8,26 11.5,23.3 11.5,13 | 11.5,13 11.5,1 12,0.5 99.5,0.5 99.5,19.81 99.31,20 89,20 88.48,20.52 SV1.1 | 16,93 v17,93 30,93 31,94 31,99 31.5,99.5 99.5,99.5 99.5,26.5 99,26 90.5,26 88.5,24 88.5,23.02 | C5.+ 11.5,13 | PAD63.1 7.5,62.75 v7.5,88
  Bottom 0.406: IC1.18 11.2,29.45 11.69,29.94 12.91,29.94 C3.1 12.75,29.78 12.75,28.81 IC1.20 12.25,28.25 10,26 v8.8,26 IC1.6 4.28,21.48 C4.1 4.89,20.89 5.06,21.06 6.13,21.06 IC1.4
  Bottom 1: v7.5,88 10.88,91.38 16.5,91.38 17,91.88 v17,93

### Text on the board
tPlace: 4x4 HID BOARD | ENCODERS | 1.5K | WITH | USB PUP | SWITCH | MX | SWITCHES | GND | VCC | D+ | D- | WITH | CUT OUT | CUT OUT | CUT OUT | CUT OUT | RGB LED | MX | SWITCHES | I2C | WITH | CUT OUT | CUT OUT | CUT OUT | CUT OUT | RGB LED | USB | VCC | GND | SCL | SDA | INTRQ | A | A | A | A | TACT | SWITCHES | WITH | LED | K | K | K | K | V1.0 | 2019-02-22 | designed by semicontinuity
bPlace: GND | VCC | D+ | D- | ZENER | FOR | USB | MOSI | ADC6 | SCK | MISO | VCC | GND | SCL | SDA | INTRQ | ADC7 | RESET